# Altium project CPLD-V.PrjPcb
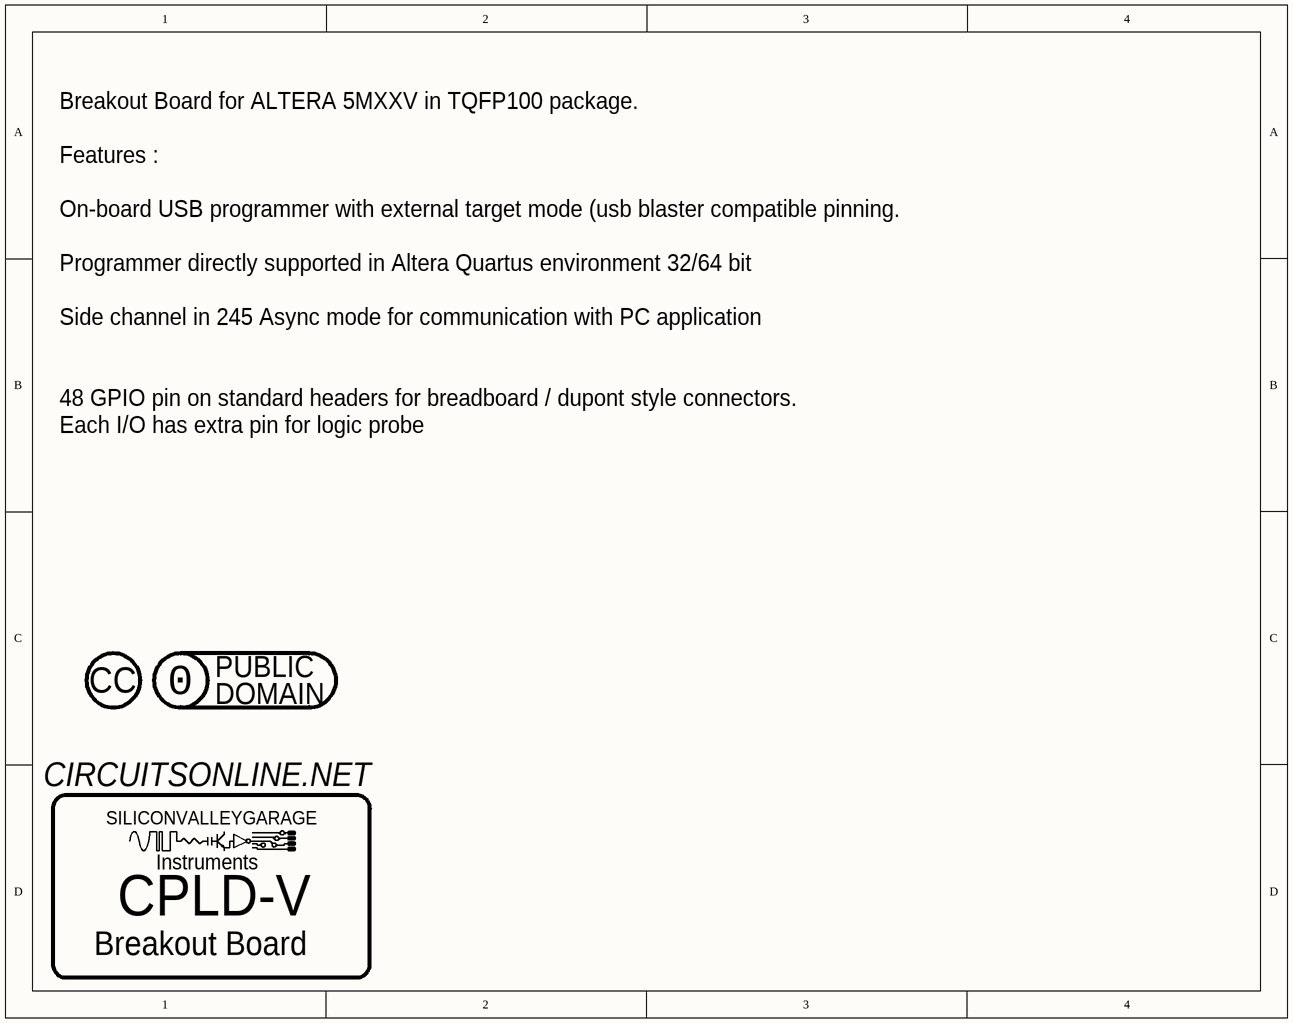
[diagram p0: CPLD-V INFORMATION.SchDoc]
SCHdrafter: Vincent Himpe
3 sheets, 167 parts. Net scope: hierarchical (ports join the sheet entries above them; power ports are global).
Board file: CPLD-V.PcbDoc
Sheets:
  CPLD-V INFORMATION.SchDoc
  CPLD-V MAIN.SchDoc
    U_CPLD-V-HEADERBANK = CPLD-V-HEADERBANK.SchDoc
    U_CPLD-V-HEADERBANK = CPLD-V-HEADERBANK.SchDoc
    U_CPLD-V-HEADERBANK = CPLD-V-HEADERBANK.SchDoc
    U_CPLD-V-HEADERBANK = CPLD-V-HEADERBANK.SchDoc
    U_CPLD-V-HEADERBANK = CPLD-V-HEADERBANK.SchDoc
    U_CPLD-V-HEADERBANK = CPLD-V-HEADERBANK.SchDoc

## Sheet CPLD-V INFORMATION.SchDoc
size A; SheetNumber: 1; SheetTotal: 3

### Parts
(Parts that share a designator on the sheet are numbered #1, #2 ... from top to bottom, then left to right.)
LOGO5  LOGO-LICENSE-CC0-PUBLIC  [LOGO-LICENSE-CC0-PUBLIC]  (value not drawn)  (no BOM)
LOGO6  LOGO-LICENSE-CC  [LOGO-LICENSE-CC]  (value not drawn)  (no BOM)
LOGO?#1  LOGO-SILICONVALLEYGARAGE-SMALL  [SILICONVALLEYGARAGE]  (value not drawn)  (graphical)

### Blocks framed on the sheet
CPLD-V: LOGO?#1

### Notes on the sheet
- Breakout Board for ALTERA 5MXXV in TQFP100 package.
  Features :
  On-board USB programmer with external target mode (usb blaster compatible pinning.
  Programmer directly supported in Altera Quartus environment 32/64 bit
  Side channel in 245 Async mode for communication with PC application
  48 GPIO pin on standard headers for breadboard / dupont style connectors.
  Each I/O has extra pin for logic probe
- (near LOGO?#1) CIRCUITSONLINE.NET
- (near LOGO?#1) Instruments
- Breakout Board
- (in symbol LOGO-LICENSE-CC) CC
- (in symbol LOGO-LICENSE-CC0-PUBLIC) PUBLIC; 0; DOMAIN
- (in symbol LOGO-SILICONVALLEYGARAGE-SMALL) SILICONVALLEYGARAGE

### Library data of the parts
LOGO?#1 = LOGO-SILICONVALLEYGARAGE-SMALL: LOGO,SILICONVALLEYGARAGE,SMALL

## Sheet CPLD-V MAIN.SchDoc
size A2; SheetNumber: 2; SheetTotal: 3
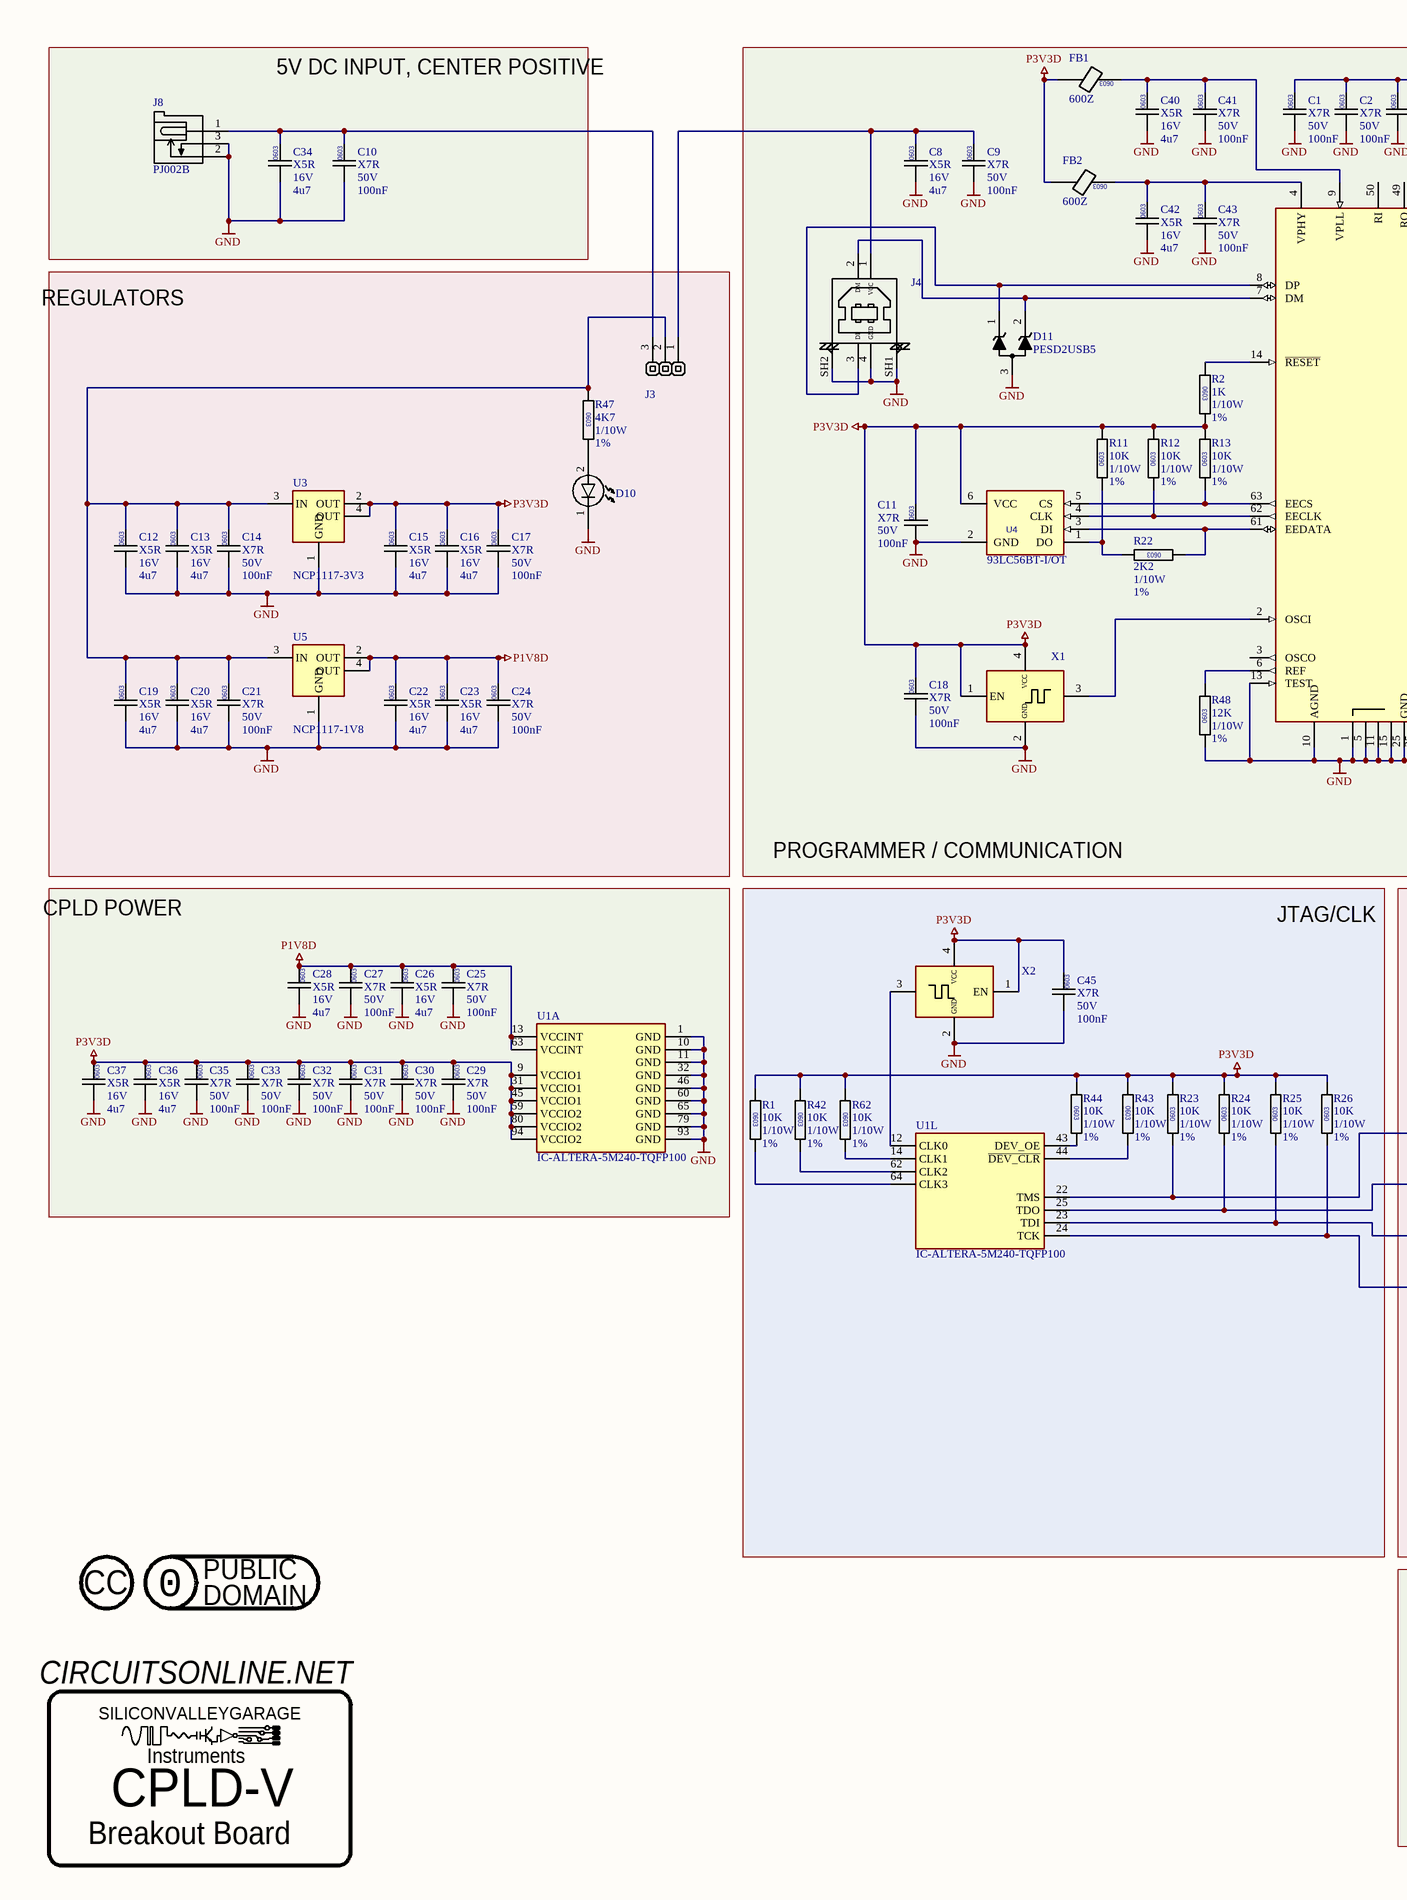
[diagram p1: CPLD-V MAIN.SchDoc, left]
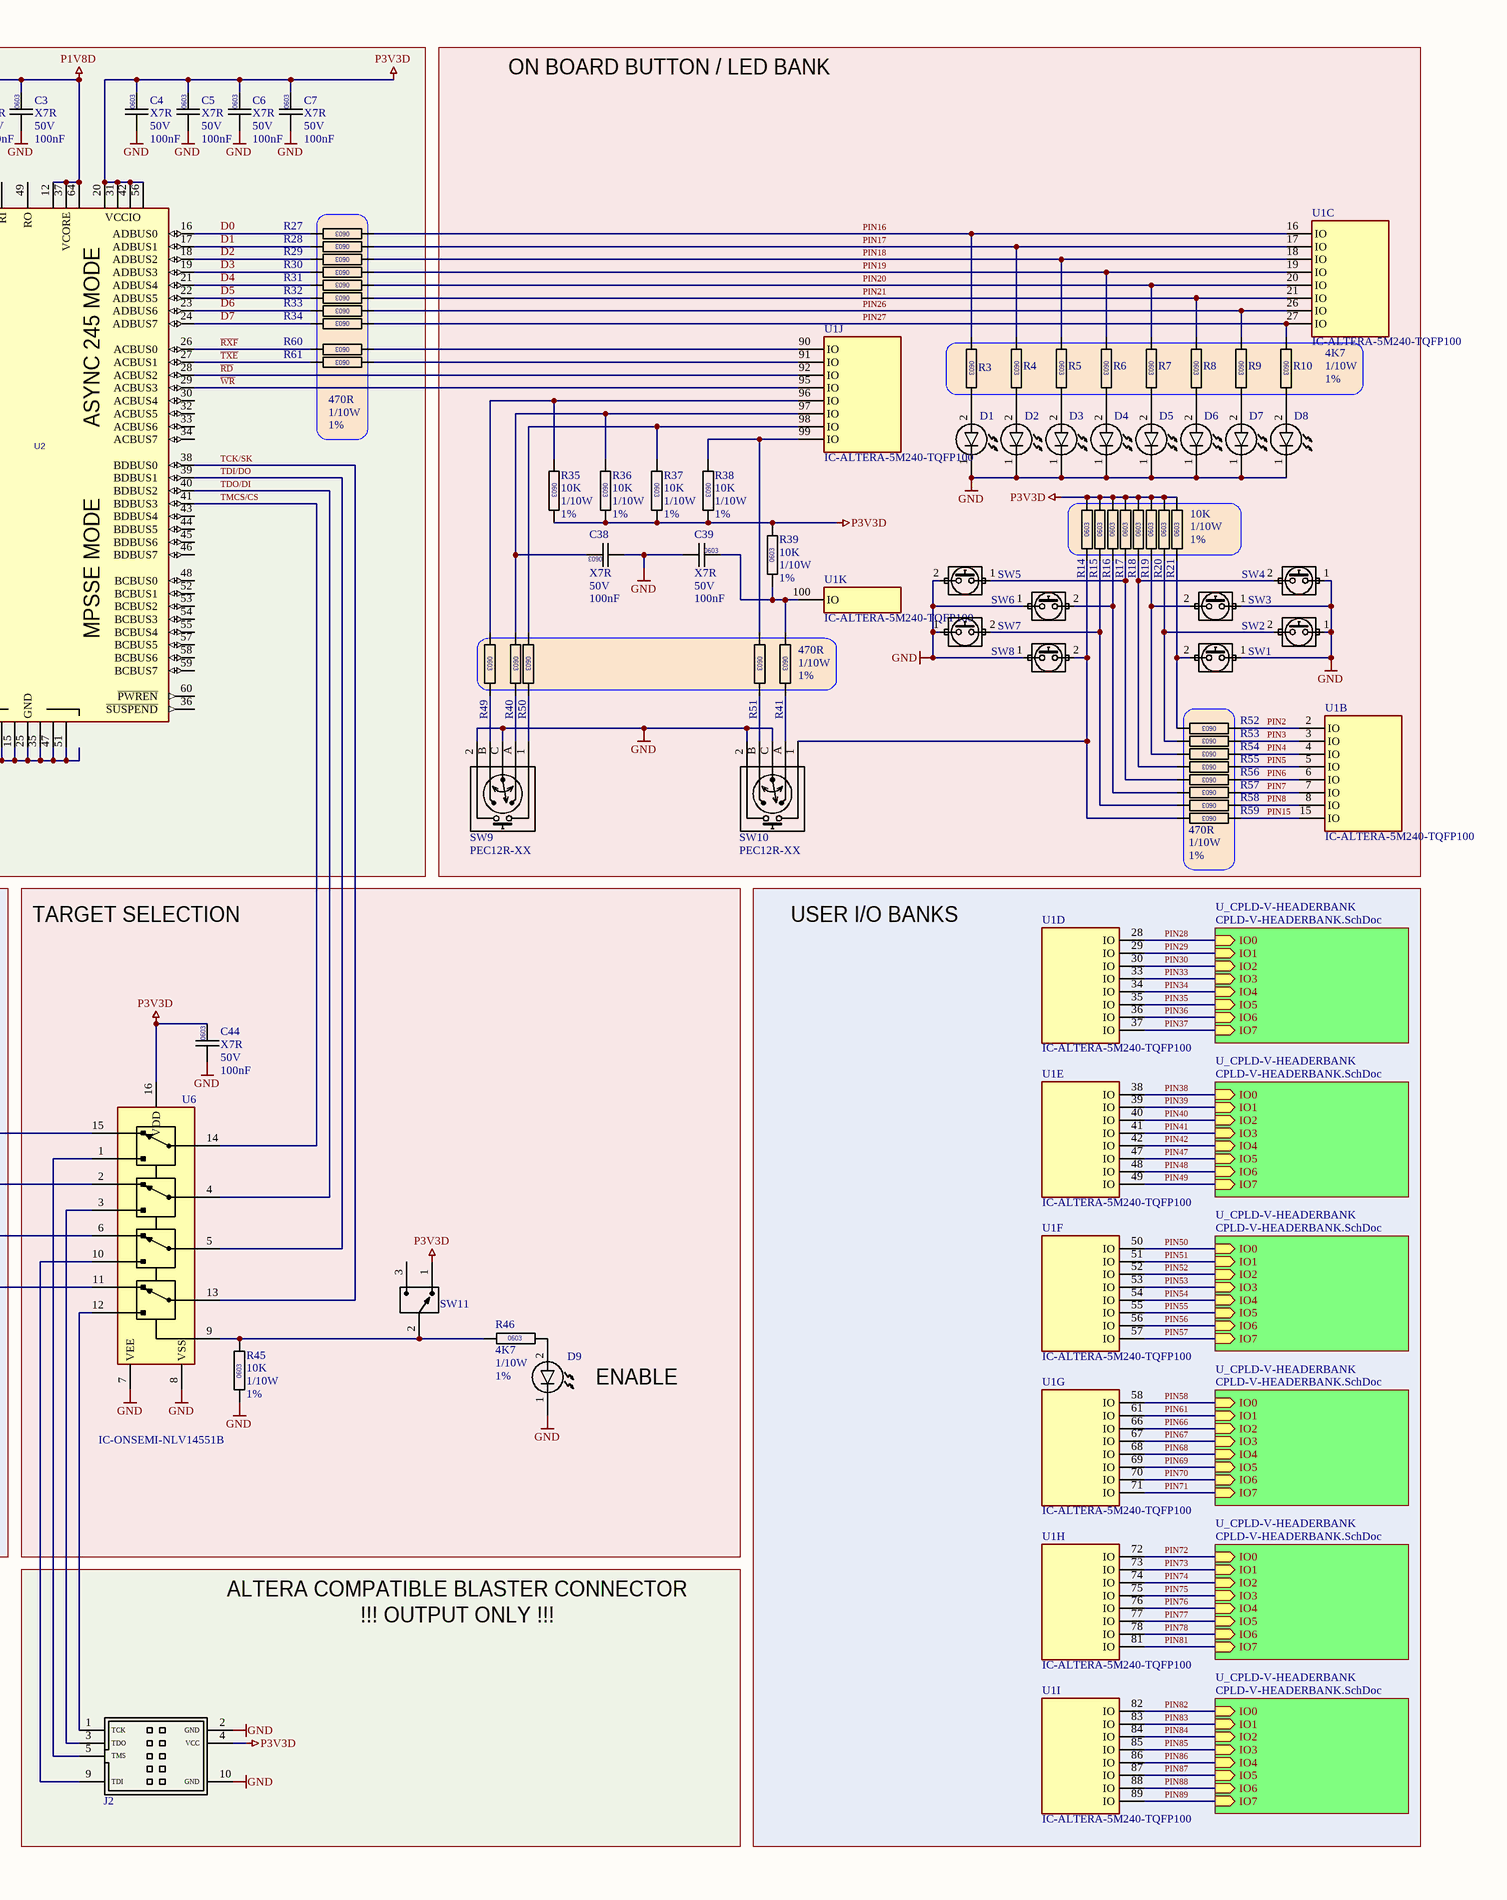
[diagram p2: CPLD-V MAIN.SchDoc, right]

### Parts
(Parts that share a designator on the sheet are numbered #1, #2 ... from top to bottom, then left to right.)
C1  Dielectric: X7R  Voltage: 50V  Capacitance: 100nF  [CAPC0603]  (hidden comment: CAP0603)
C2  Dielectric: X7R  Voltage: 50V  Capacitance: 100nF  [CAPC0603]  (hidden comment: CAP0603)
C3  Dielectric: X7R  Voltage: 50V  Capacitance: 100nF  [CAPC0603]  (hidden comment: CAP0603)
C4  Dielectric: X7R  Voltage: 50V  Capacitance: 100nF  [CAPC0603]  (hidden comment: CAP0603)
C5  Dielectric: X7R  Voltage: 50V  Capacitance: 100nF  [CAPC0603]  (hidden comment: CAP0603)
C6  Dielectric: X7R  Voltage: 50V  Capacitance: 100nF  [CAPC0603]  (hidden comment: CAP0603)
C7  Dielectric: X7R  Voltage: 50V  Capacitance: 100nF  [CAPC0603]  (hidden comment: CAP0603)
C8  Dielectric: X5R  Voltage: 16V  Capacitance: 4u7  [CAPC0603]  (hidden comment: CAP0603)
C9  Dielectric: X7R  Voltage: 50V  Capacitance: 100nF  [CAPC0603]  (hidden comment: CAP0603)
C10  Dielectric: X7R  Voltage: 50V  Capacitance: 100nF  [CAPC0603]  (hidden comment: CAP0603)
C11  Dielectric: X7R  Voltage: 50V  Capacitance: 100nF  [CAPC0603]  (hidden comment: CAP0603)
C12  Dielectric: X5R  Voltage: 16V  Capacitance: 4u7  [CAPC0603]  (hidden comment: CAP0603)
C13  Dielectric: X5R  Voltage: 16V  Capacitance: 4u7  [CAPC0603]  (hidden comment: CAP0603)
C14  Dielectric: X7R  Voltage: 50V  Capacitance: 100nF  [CAPC0603]  (hidden comment: CAP0603)
C15  Dielectric: X5R  Voltage: 16V  Capacitance: 4u7  [CAPC0603]  (hidden comment: CAP0603)
C16  Dielectric: X5R  Voltage: 16V  Capacitance: 4u7  [CAPC0603]  (hidden comment: CAP0603)
C17  Dielectric: X7R  Voltage: 50V  Capacitance: 100nF  [CAPC0603]  (hidden comment: CAP0603)
C18  Dielectric: X7R  Voltage: 50V  Capacitance: 100nF  [CAPC0603]  (hidden comment: CAP0603)
C19  Dielectric: X5R  Voltage: 16V  Capacitance: 4u7  [CAPC0603]  (hidden comment: CAP0603)
C20  Dielectric: X5R  Voltage: 16V  Capacitance: 4u7  [CAPC0603]  (hidden comment: CAP0603)
C21  Dielectric: X7R  Voltage: 50V  Capacitance: 100nF  [CAPC0603]  (hidden comment: CAP0603)
C22  Dielectric: X5R  Voltage: 16V  Capacitance: 4u7  [CAPC0603]  (hidden comment: CAP0603)
C23  Dielectric: X5R  Voltage: 16V  Capacitance: 4u7  [CAPC0603]  (hidden comment: CAP0603)
C24  Dielectric: X7R  Voltage: 50V  Capacitance: 100nF  [CAPC0603]  (hidden comment: CAP0603)
C25  Dielectric: X7R  Voltage: 50V  Capacitance: 100nF  [CAPC0603]  (hidden comment: CAP0603)
C26  Dielectric: X5R  Voltage: 16V  Capacitance: 4u7  [CAPC0603]  (hidden comment: CAP0603)
C27  Dielectric: X7R  Voltage: 50V  Capacitance: 100nF  [CAPC0603]  (hidden comment: CAP0603)
C28  Dielectric: X5R  Voltage: 16V  Capacitance: 4u7  [CAPC0603]  (hidden comment: CAP0603)
C29  Dielectric: X7R  Voltage: 50V  Capacitance: 100nF  [CAPC0603]  (hidden comment: CAP0603)
C30  Dielectric: X7R  Voltage: 50V  Capacitance: 100nF  [CAPC0603]  (hidden comment: CAP0603)
C31  Dielectric: X7R  Voltage: 50V  Capacitance: 100nF  [CAPC0603]  (hidden comment: CAP0603)
C32  Dielectric: X7R  Voltage: 50V  Capacitance: 100nF  [CAPC0603]  (hidden comment: CAP0603)
C33  Dielectric: X7R  Voltage: 50V  Capacitance: 100nF  [CAPC0603]  (hidden comment: CAP0603)
C34  Dielectric: X5R  Voltage: 16V  Capacitance: 4u7  [CAPC0603]  (hidden comment: CAP0603)
C35  Dielectric: X7R  Voltage: 50V  Capacitance: 100nF  [CAPC0603]  (hidden comment: CAP0603)
C36  Dielectric: X5R  Voltage: 16V  Capacitance: 4u7  [CAPC0603]  (hidden comment: CAP0603)
C37  Dielectric: X5R  Voltage: 16V  Capacitance: 4u7  [CAPC0603]  (hidden comment: CAP0603)
C38  Dielectric: X7R  Voltage: 50V  Capacitance: 100nF  [CAPC0603]  (hidden comment: CAP0603)
C39  Dielectric: X7R  Voltage: 50V  Capacitance: 100nF  [CAPC0603]  (hidden comment: CAP0603)
C40  Dielectric: X5R  Voltage: 16V  Capacitance: 4u7  [CAPC0603]  (hidden comment: CAP0603)
C41  Dielectric: X7R  Voltage: 50V  Capacitance: 100nF  [CAPC0603]  (hidden comment: CAP0603)
C42  Dielectric: X5R  Voltage: 16V  Capacitance: 4u7  [CAPC0603]  (hidden comment: CAP0603)
C43  Dielectric: X7R  Voltage: 50V  Capacitance: 100nF  [CAPC0603]  (hidden comment: CAP0603)
C44  Dielectric: X7R  Voltage: 50V  Capacitance: 100nF  [CAPC0603]  (hidden comment: CAP0603)
C45  Dielectric: X7R  Voltage: 50V  Capacitance: 100nF  [CAPC0603]  (hidden comment: CAP0603)
D1  KT-0603W  [LED-0603-GREEN]  (value not drawn)
D2  KT-0603W  [LED-0603-GREEN]  (value not drawn)
D3  KT-0603W  [LED-0603-GREEN]  (value not drawn)
D4  KT-0603W  [LED-0603-GREEN]  (value not drawn)
D5  KT-0603W  [LED-0603-GREEN]  (value not drawn)
D6  KT-0603W  [LED-0603-GREEN]  (value not drawn)
D7  KT-0603W  [LED-0603-GREEN]  (value not drawn)
D8  KT-0603W  [LED-0603-GREEN]  (value not drawn)
D9  KT-0603W  [LED-0603-GREEN]  (value not drawn)
D10  KT-0603W  [LED-0603-GREEN]  (value not drawn)
D11  PESD2USB5  [SOT23]
FB1  value 600Z  [FB0603]  (hidden comment: FB0603)
FB2  value 600Z  [FB0603]  (hidden comment: FB0603)
J2  ALTERA  [CONNECTOR GENERIC-BOXHEADER-2X5]  (value not drawn)
J3  BOXHEADER-2X4  [HEADER-GENERIC-MALE-1X3]  (value not drawn)
J4  CONN-CUI-UJ2-BH-BL1-TH  [CONN-CUI-UJ2-BH-BL1-TH]  (value not drawn)
J8  PJ002B  [CONN-CUI-PJ-002B]
LOGO1  LOGO-LICENSE-CC0-PUBLIC  [LOGO-LICENSE-CC0-PUBLIC]  (value not drawn)  (no BOM)
LOGO2  LOGO-LICENSE-CC  [LOGO-LICENSE-CC]  (value not drawn)  (no BOM)
LOGO?#2  LOGO-SILICONVALLEYGARAGE-SMALL  [SILICONVALLEYGARAGE]  (value not drawn)  (graphical)
R1  value 10K  Power: 1/10W  Tolerance: 1%  [RESC0603]  (hidden comment: RESC0603)
R2  value 1K  Power: 1/10W  Tolerance: 1%  [RESC0603]  (hidden comment: RESC0603)
R3  value 4K7  Power: 1/10W  Tolerance: 1%  [RESC0603]  (hidden comment: RESC0603)
R4  RESC0603  [RESC0603]  (value not drawn)
R5  RESC0603  [RESC0603]  (value not drawn)
R6  RESC0603  [RESC0603]  (value not drawn)
R7  RESC0603  [RESC0603]  (value not drawn)
R8  RESC0603  [RESC0603]  (value not drawn)
R9  RESC0603  [RESC0603]  (value not drawn)
R10  RESC0603  [RESC0603]  (value not drawn)
R11  value 10K  Power: 1/10W  Tolerance: 1%  [RESC0603]  (hidden comment: RESC0603)
R12  value 10K  Power: 1/10W  Tolerance: 1%  [RESC0603]  (hidden comment: RESC0603)
R13  value 10K  Power: 1/10W  Tolerance: 1%  [RESC0603]  (hidden comment: RESC0603)
R14  value 10K  Power: 1/10W  Tolerance: 1%  [RESC0603]  (hidden comment: RESC0603)
R15  RESC0603  [RESC0603]  (value not drawn)
R16  RESC0603  [RESC0603]  (value not drawn)
R17  RESC0603  [RESC0603]  (value not drawn)
R18  RESC0603  [RESC0603]  (value not drawn)
R19  RESC0603  [RESC0603]  (value not drawn)
R20  RESC0603  [RESC0603]  (value not drawn)
R21  RESC0603  [RESC0603]  (value not drawn)
R22  value 2K2  Power: 1/10W  Tolerance: 1%  [RESC0603]  (hidden comment: RESC0603)
R23  value 10K  Power: 1/10W  Tolerance: 1%  [RESC0603]  (hidden comment: RESC0603)
R24  value 10K  Power: 1/10W  Tolerance: 1%  [RESC0603]  (hidden comment: RESC0603)
R25  value 10K  Power: 1/10W  Tolerance: 1%  [RESC0603]  (hidden comment: RESC0603)
R26  value 10K  Power: 1/10W  Tolerance: 1%  [RESC0603]  (hidden comment: RESC0603)
R27  RESC0603  [RESC0603]  (value not drawn)
R28  RESC0603  [RESC0603]  (value not drawn)
R29  RESC0603  [RESC0603]  (value not drawn)
R30  RESC0603  [RESC0603]  (value not drawn)
R31  RESC0603  [RESC0603]  (value not drawn)
R32  RESC0603  [RESC0603]  (value not drawn)
R33  RESC0603  [RESC0603]  (value not drawn)
R34  RESC0603  [RESC0603]  (value not drawn)
R35  value 10K  Power: 1/10W  Tolerance: 1%  [RESC0603]  (hidden comment: RESC0603)
R36  value 10K  Power: 1/10W  Tolerance: 1%  [RESC0603]  (hidden comment: RESC0603)
R37  value 10K  Power: 1/10W  Tolerance: 1%  [RESC0603]  (hidden comment: RESC0603)
R38  value 10K  Power: 1/10W  Tolerance: 1%  [RESC0603]  (hidden comment: RESC0603)
R39  value 10K  Power: 1/10W  Tolerance: 1%  [RESC0603]  (hidden comment: RESC0603)
R40  RESC0603  [RESC0603]  (value not drawn)
R41  value 470R  Power: 1/10W  Tolerance: 1%  [RESC0603]  (hidden comment: RESC0603)
R42  value 10K  Power: 1/10W  Tolerance: 1%  [RESC0603]  (hidden comment: RESC0603)
R43  value 10K  Power: 1/10W  Tolerance: 1%  [RESC0603]  (hidden comment: RESC0603)
R44  value 10K  Power: 1/10W  Tolerance: 1%  [RESC0603]  (hidden comment: RESC0603)
R45  value 10K  Power: 1/10W  Tolerance: 1%  [RESC0603]  (hidden comment: RESC0603)
R46  value 4K7  Power: 1/10W  Tolerance: 1%  [RESC0603]  (hidden comment: RESC0603)
R47  value 4K7  Power: 1/10W  Tolerance: 1%  [RESC0603]  (hidden comment: RESC0603)
R48  value 12K  Power: 1/10W  Tolerance: 1%  [RESC0603]  (hidden comment: RESC0603)
R49  RESC0603  [RESC0603]  (value not drawn)
R50  RESC0603  [RESC0603]  (value not drawn)
R51  RESC0603  [RESC0603]  (value not drawn)
R52  RESC0603  [RESC0603]  (value not drawn)
R53  RESC0603  [RESC0603]  (value not drawn)
R54  RESC0603  [RESC0603]  (value not drawn)
R55  RESC0603  [RESC0603]  (value not drawn)
R56  RESC0603  [RESC0603]  (value not drawn)
R57  RESC0603  [RESC0603]  (value not drawn)
R58  RESC0603  [RESC0603]  (value not drawn)
R59  value 470R  Power: 1/10W  Tolerance: 1%  [RESC0603]  (hidden comment: RESC0603)
R60  RESC0603  [RESC0603]  (value not drawn)
R61  value 470R  Power: 1/10W  Tolerance: 1%  [RESC0603]  (hidden comment: RESC0603)
R62  value 10K  Power: 1/10W  Tolerance: 1%  [RESC0603]  (hidden comment: RESC0603)
SW1  SWITCH-XUNPU-TS-1088-AR02016  [SWITCH-XUNPU-TS-1088-AR02016]  (value not drawn)
SW2  SWITCH-XUNPU-TS-1088-AR02016  [SWITCH-XUNPU-TS-1088-AR02016]  (value not drawn)
SW3  SWITCH-XUNPU-TS-1088-AR02016  [SWITCH-XUNPU-TS-1088-AR02016]  (value not drawn)
SW4  SWITCH-XUNPU-TS-1088-AR02016  [SWITCH-XUNPU-TS-1088-AR02016]  (value not drawn)
SW5  SWITCH-XUNPU-TS-1088-AR02016  [SWITCH-XUNPU-TS-1088-AR02016]  (value not drawn)
SW6  SWITCH-XUNPU-TS-1088-AR02016  [SWITCH-XUNPU-TS-1088-AR02016]  (value not drawn)
SW7  SWITCH-XUNPU-TS-1088-AR02016  [SWITCH-XUNPU-TS-1088-AR02016]  (value not drawn)
SW8  SWITCH-XUNPU-TS-1088-AR02016  [SWITCH-XUNPU-TS-1088-AR02016]  (value not drawn)
SW9  PEC12R-XX  [SWITCH-BOURNS-PEC12R-4120F-S0012]
SW10  PEC12R-XX  [SWITCH-BOURNS-PEC12R-4120F-S0012]
SW11  SWITCH-WURTH-450301014042  [SWITCH-WURTH-450301014042]  (value not drawn)
U1  IC-ALTERA-5M240-TQFP100  [QFP50P1600X1600X160-100N]  (parts A,B,C,D,E,F,G,H,I,J,K,L of 12)
U2  FT2232H  [QFP50P1000X1000X100-64N]  (value not drawn)
U3  NCP1117-3V3  [SOT223-4N]
U4  93LC56BT-I/OT  [SOT23-6]
U5  NCP1117-1V8  [SOT223-4N]
U6  IC-ONSEMI-NLV14551B  [SO127P600-16N]
X1  XOSC  [XTAL-ABRACON-ABM8-272-T3]  (value not drawn)
X2  XOSC  [XOSC3225]  (value not drawn)

### Blocks framed on the sheet
5V DC INPUT, CENTER POSITIVE: C10 C34 J8
ON BOARD BUTTON / LED BANK: C38 C39 D1-D8 R3-R10 R14-R21 R35-R41 R49-R59 SW1-SW10 U1
REGULATORS: C12-C17 C19-C24 D10 J3 R47 U3 U5
CPLD POWER: C25-C33 C35-C37 U1
JTAG/CLK: C45 R1 R23-R26 R42-R44 R62 U1 X2
USER I/O BANKS: U1
CPLD-V: LOGO?#2

### Sub-sheets
U_CPLD-V-HEADERBANK = CPLD-V-HEADERBANK.SchDoc: IO0 (in), IO1 (in), IO2 (in), IO3 (in), IO4 (in), IO5 (in), IO6 (in), IO7 (in)
U_CPLD-V-HEADERBANK = CPLD-V-HEADERBANK.SchDoc: IO0 (in), IO1 (in), IO2 (in), IO3 (in), IO4 (in), IO5 (in), IO6 (in), IO7 (in)
U_CPLD-V-HEADERBANK = CPLD-V-HEADERBANK.SchDoc: IO0 (in), IO1 (in), IO2 (in), IO3 (in), IO4 (in), IO5 (in), IO6 (in), IO7 (in)
U_CPLD-V-HEADERBANK = CPLD-V-HEADERBANK.SchDoc: IO0 (in), IO1 (in), IO2 (in), IO3 (in), IO4 (in), IO5 (in), IO6 (in), IO7 (in)
U_CPLD-V-HEADERBANK = CPLD-V-HEADERBANK.SchDoc: IO0 (in), IO1 (in), IO2 (in), IO3 (in), IO4 (in), IO5 (in), IO6 (in), IO7 (in)
U_CPLD-V-HEADERBANK = CPLD-V-HEADERBANK.SchDoc: IO0 (in), IO1 (in), IO2 (in), IO3 (in), IO4 (in), IO5 (in), IO6 (in), IO7 (in)

### Nets
GND: C1.2 C2.2 C3.2 C4.2 C5.2 C6.2 C7.2 C8.2 C9.2 C10.2 C11.2 C12.2 C13.2 C14.2 C15.2 C16.2 C17.2 C18.2 C19.2 C20.2 C21.2 C22.2 C23.2 C24.2 C25.2 C26.2 C27.2 C28.2 C29.2 C30.2 C31.2 C32.2 C33.2 C34.2 C35.2 C36.2 C37.2 C38.2 C39.2 C40.2 C41.2 C42.2 C43.2 C44.2 C45.2 D1.1(A) D2.1(A) D3.1(A) D4.1(A) D5.1(A) D6.1(A) D7.1(A) D8.1(A) D9.1(A) D10.1(A) D11.3(A) J2.2(GND) J2.10(GND) J4.4(GND) J4.SH1(NO) J4.SH2(NO) J8.2 J8.3 R45.2 R48.2 SW1.1 SW2.1 SW3.1 SW4.1 SW5.2 SW6.1 SW7.1 SW8.1 SW9.2 SW9.C SW10.2 SW10.C U1.1(GND) U1.10(GND) U1.11(GND) U1.32(GND) U1.46(GND) U1.60(GND) U1.65(GND) U1.79(GND) U1.93(GND) U2.1(GND) U2.5(GND) U2.10(AGND) U2.11(GND) U2.13(TEST) U2.15(GND) U2.25(GND) U2.35(GND) U2.47(GND) U2.51(GND) U3.1(GND) U4.2(GND) U5.1(GND) U6.7(VEE) U6.8(VSS) X1.2(GND) X2.2(GND)
P1V8D: C1.1 C2.1 C3.1 C22.1 C23.1 C24.1 C25.1 C26.1 C27.1 C28.1 U1.13(VCCINT) U1.63(VCCINT) U2.12(VCORE) U2.37(VCORE) U2.64(VCORE) U5.2(OUT) U5.4(OUT)
P3V3D: C4.1 C5.1 C6.1 C7.1 C11.1 C15.1 C16.1 C17.1 C18.1 C29.1 C30.1 C31.1 C32.1 C33.1 C35.1 C36.1 C37.1 C44.1 C45.1 FB1.2 FB2.2 J2.4(VCC) R1.2 R2.1 R11.1 R12.1 R13.1 R14.1 R15.1 R16.1 R17.1 R18.1 R19.1 R20.1 R21.1 R23.1 R24.1 R25.1 R26.1 R35.1 R36.1 R37.1 R38.1 R39.1 R42.2 R43.2 R44.2 R62.2 SW11.1 U1.9(VCCIO1) U1.31(VCCIO1) U1.45(VCCIO1) U1.59(VCCIO2) U1.80(VCCIO2) U1.94(VCCIO2) U2.20(VCCIO) U2.31(VCCIO) U2.42(VCCIO) U2.56(VCCIO) U3.2(OUT) U3.4(OUT) U4.6(VCC) U6.16(VDD) X1.1(EN) X1.4(VCC) X2.1(EN) X2.4(VCC)
D0: R27.1 U2.16(ADBUS0)
D1: R28.1 U2.17(ADBUS1)
D2: R29.1 U2.18(ADBUS2)
D3: R30.1 U2.19(ADBUS3)
D4: R31.1 U2.21(ADBUS4)
D5: R32.1 U2.22(ADBUS5)
D6: R33.1 U2.23(ADBUS6)
D7: R34.1 U2.24(ADBUS7)
PIN2: R52.2 U1.2(IO)
PIN3: R53.2 U1.3(IO)
PIN4: R54.2 U1.4(IO)
PIN5: R55.2 U1.5(IO)
PIN6: R56.2 U1.6(IO)
PIN7: R57.2 U1.7(IO)
PIN8: R58.2 U1.8(IO)
PIN15: R59.2 U1.15(IO)
PIN16: R3.2 R27.2 U1.16(IO)
PIN17: R4.2 R28.2 U1.17(IO)
PIN18: R5.2 R29.2 U1.18(IO)
PIN19: R6.2 R30.2 U1.19(IO)
PIN20: R7.2 R31.2 U1.20(IO)
PIN21: R8.2 R32.2 U1.21(IO)
PIN26: R9.2 R33.2 U1.26(IO)
PIN27: R10.2 R34.2 U1.27(IO)
PIN28: U1.28(IO) ; sheet U_CPLD-V-HEADERBANK/IO0
PIN29: U1.29(IO) ; sheet U_CPLD-V-HEADERBANK/IO1
PIN30: U1.30(IO) ; sheet U_CPLD-V-HEADERBANK/IO2
PIN33: U1.33(IO) ; sheet U_CPLD-V-HEADERBANK/IO3
PIN34: U1.34(IO) ; sheet U_CPLD-V-HEADERBANK/IO4
PIN35: U1.35(IO) ; sheet U_CPLD-V-HEADERBANK/IO5
PIN36: U1.36(IO) ; sheet U_CPLD-V-HEADERBANK/IO6
PIN37: U1.37(IO) ; sheet U_CPLD-V-HEADERBANK/IO7
PIN38: U1.38(IO) ; sheet U_CPLD-V-HEADERBANK/IO0
PIN39: U1.39(IO) ; sheet U_CPLD-V-HEADERBANK/IO1
PIN40: U1.40(IO) ; sheet U_CPLD-V-HEADERBANK/IO2
PIN41: U1.41(IO) ; sheet U_CPLD-V-HEADERBANK/IO3
PIN42: U1.42(IO) ; sheet U_CPLD-V-HEADERBANK/IO4
PIN47: U1.47(IO) ; sheet U_CPLD-V-HEADERBANK/IO5
PIN48: U1.48(IO) ; sheet U_CPLD-V-HEADERBANK/IO6
PIN49: U1.49(IO) ; sheet U_CPLD-V-HEADERBANK/IO7
PIN50: U1.50(IO) ; sheet U_CPLD-V-HEADERBANK/IO0
PIN51: U1.51(IO) ; sheet U_CPLD-V-HEADERBANK/IO1
PIN52: U1.52(IO) ; sheet U_CPLD-V-HEADERBANK/IO2
PIN53: U1.53(IO) ; sheet U_CPLD-V-HEADERBANK/IO3
PIN54: U1.54(IO) ; sheet U_CPLD-V-HEADERBANK/IO4
PIN55: U1.55(IO) ; sheet U_CPLD-V-HEADERBANK/IO5
PIN56: U1.56(IO) ; sheet U_CPLD-V-HEADERBANK/IO6
PIN57: U1.57(IO) ; sheet U_CPLD-V-HEADERBANK/IO7
PIN58: U1.58(IO) ; sheet U_CPLD-V-HEADERBANK/IO0
PIN61: U1.61(IO) ; sheet U_CPLD-V-HEADERBANK/IO1
PIN66: U1.66(IO) ; sheet U_CPLD-V-HEADERBANK/IO2
PIN67: U1.67(IO) ; sheet U_CPLD-V-HEADERBANK/IO3
PIN68: U1.68(IO) ; sheet U_CPLD-V-HEADERBANK/IO4
PIN69: U1.69(IO) ; sheet U_CPLD-V-HEADERBANK/IO5
PIN70: U1.70(IO) ; sheet U_CPLD-V-HEADERBANK/IO6
PIN71: U1.71(IO) ; sheet U_CPLD-V-HEADERBANK/IO7
PIN72: U1.72(IO) ; sheet U_CPLD-V-HEADERBANK/IO0
PIN73: U1.73(IO) ; sheet U_CPLD-V-HEADERBANK/IO1
PIN74: U1.74(IO) ; sheet U_CPLD-V-HEADERBANK/IO2
PIN75: U1.75(IO) ; sheet U_CPLD-V-HEADERBANK/IO3
PIN76: U1.76(IO) ; sheet U_CPLD-V-HEADERBANK/IO4
PIN77: U1.77(IO) ; sheet U_CPLD-V-HEADERBANK/IO5
PIN78: U1.78(IO) ; sheet U_CPLD-V-HEADERBANK/IO6
PIN81: U1.81(IO) ; sheet U_CPLD-V-HEADERBANK/IO7
PIN82: U1.82(IO) ; sheet U_CPLD-V-HEADERBANK/IO0
PIN83: U1.83(IO) ; sheet U_CPLD-V-HEADERBANK/IO1
PIN84: U1.84(IO) ; sheet U_CPLD-V-HEADERBANK/IO2
PIN85: U1.85(IO) ; sheet U_CPLD-V-HEADERBANK/IO3
PIN86: U1.86(IO) ; sheet U_CPLD-V-HEADERBANK/IO4
PIN87: U1.87(IO) ; sheet U_CPLD-V-HEADERBANK/IO5
PIN88: U1.88(IO) ; sheet U_CPLD-V-HEADERBANK/IO6
PIN89: U1.89(IO) ; sheet U_CPLD-V-HEADERBANK/IO7
~{RD}: U1.92(IO) U2.28(ACBUS2)
~{RXF}: R60.1 U2.26(ACBUS0)
~{TXE}: R61.1 U2.27(ACBUS1)
TCK/SK: U2.38(BDBUS0) U6.13(Z)
TDI/DO: U2.39(BDBUS1) U6.5(Y)
TDO/DI: U2.40(BDBUS2) U6.4(X)
TMCS/CS: U2.41(BDBUS3) U6.14(W)
~{WR}: U1.95(IO) U2.29(ACBUS3)
NetC8_1: C8.1 C9.1 J3.1(+) J4.1(VCC)
NetC10_1: C10.1 C34.1 J3.3(-) J8.1
NetC12_1: C12.1 C13.1 C14.1 C19.1 C20.1 C21.1 J3.2(-) R47.2 U3.3(IN) U5.3(IN)
NetC38_1: C38.1 R36.2 R40.2 U1.97(IO)
NetC39_1: C39.1 R39.2 R41.2 U1.100(IO)
NetC40_1: C40.1 C41.1 FB1.1 U2.9(VPLL)
NetC42_1: C42.1 C43.1 FB2.1 U2.4(VPHY)
NetD1_2: D1.2(K) R3.1
NetD2_2: D2.2(K) R4.1
NetD3_2: D3.2(K) R5.1
NetD4_2: D4.2(K) R6.1
NetD5_2: D5.2(K) R7.1
NetD6_2: D6.2(K) R8.1
NetD7_2: D7.2(K) R9.1
NetD8_2: D8.2(K) R10.1
NetD9_2: D9.2(K) R46.1
NetD10_2: D10.2(K) R47.1
NetD11_1: D11.1(K) J4.3(DP) U2.8(DP)
NetD11_2: D11.2(A) J4.2(DM) U2.7(DM)
NetJ2_1: J2.1(TCK) U6.12(Z1)
NetJ2_3: J2.3(TDO) U6.3(X1)
NetJ2_5: J2.5(TMS) U6.1(W1)
NetJ2_9: J2.9(TDI) U6.10(Y1)
NetR1_1: R1.1 U1.64(CLK3)
NetR2_2: R2.2 U2.14(~{RESET})
NetR11_2: R11.2 R22.1 U4.1(DO)
NetR12_2: R12.2 U2.62(EECLK) U4.4(CLK)
NetR13_2: R13.2 U2.63(EECS) U4.5(CS)
NetR14_2: R14.2 R59.1 SW8.2 SW10.1
NetR15_2: R15.2 R58.1 SW7.2
NetR16_2: R16.2 R57.1 SW6.2
NetR17_2: R17.2 R56.1 SW5.1
NetR18_2: R18.2 R55.1 SW4.2
NetR19_2: R19.2 R54.1 SW3.2
NetR20_2: R20.2 R53.1 SW2.2
NetR21_2: R21.2 R52.1 SW1.2
NetR22_2: R22.2 U2.61(EEDATA) U4.3(DI)
NetR23_2: R23.2 U1.22(TMS) U6.15(W0)
NetR24_2: R24.2 U1.25(TDO) U6.2(X0)
NetR25_2: R25.2 U1.23(TDI) U6.6(Y0)
NetR26_2: R26.2 U1.24(TCK) U6.11(Z0)
NetR35_2: R35.2 R49.2 U1.96(IO)
NetR37_2: R37.2 R50.2 U1.98(IO)
NetR38_2: R38.2 R51.2 U1.99(IO)
NetR40_1: R40.1 SW9.A
NetR41_1: R41.1 SW10.A
NetR42_1: R42.1 U1.62(CLK2)
NetR43_1: R43.1 U1.44(~{DEV_CLR})
NetR44_1: R44.1 U1.43(DEV_OE)
NetR45_1: R45.1 R46.2 SW11.2 U6.9(CTRL)
NetR48_1: R48.1 U2.6(REF)
NetR49_1: R49.1 SW9.B
NetR50_1: R50.1 SW9.1
NetR51_1: R51.1 SW10.B
NetR60_2: R60.2 U1.90(IO)
NetR61_2: R61.2 U1.91(IO)
NetR62_1: R62.1 U1.14(CLK1)
NetU1_12: U1.12(CLK0) X2.3(OSC2)
NetU2_2: U2.2(OSCI) X1.3(OSC2)

Not connected (* = marked no-connect by the designer): SW11 3; U2 3(OSCO) 30(ACBUS4) 32(ACBUS5) 33(ACBUS6) 34(ACBUS7) 36(~{SUSPEND}) 43(BDBUS4) 44(BDBUS5) 45(BDBUS6) 46(BDBUS7) 48(BCBUS0) 49(RO) 50(RI) 52(BCBUS1) 53(BCBUS2) 54(BCBUS3) 55(BCBUS4) 57(BCBUS5) 58(BCBUS6) 59(BCBUS7) 60(~{PWREN})

### Notes on the sheet
- (near U2) ASYNC 245 MODE
- (near U2) MPSSE MODE
- PROGRAMMER / COMMUNICATION
- TARGET SELECTION
- ENABLE
- ALTERA COMPATIBLE BLASTER CONNECTOR
- !!! OUTPUT ONLY !!!
- (near LOGO?#2) CIRCUITSONLINE.NET
- (near LOGO?#2) Instruments
- Breakout Board
- (in symbol FB0603-600Z-0R45) 0603
- (in symbol LOGO-LICENSE-CC) CC
- (in symbol LOGO-LICENSE-CC0-PUBLIC) PUBLIC; 0; DOMAIN
- (in symbol LOGO-SILICONVALLEYGARAGE-SMALL) SILICONVALLEYGARAGE
- (in symbol RESC-0603-1K-1%-1/10W) 0603
- (in symbol RESC-0603-2K2-1%-1/10W) 0603
- (in symbol RESC-0603-4K7-1%-1/10W) 0603
- (in symbol RESC-0603-10K-1%-1/10W) 0603
- (in symbol RESC-0603-12K-1%-1/10W) 0603
- (in symbol RESC-0603-470R-1%-1/10W) 0603

### Library data of the parts
C1-C7 C9-C11 C14 C17 C18 C21 C24 C25 C27 C29-C33 C35 C38 C39 C41 C43-C45 = CAPC-0603-100nF-50V-X7R: CAPACITOR,CERAMIC,100nF,50V,X7R,0603; Manufacturer 1: KEMET; Manufacturer Part Number 1: C0603C104K5RACTU; Package / Case: 0603; Location: *; LCSC: C14663; MOUSER: 80-C0603C104K5R
C8 C12 C13 C15 C16 C19 C20 C22 C23 C26 C28 C34 C36 C37 C40 C42 = CAPC-0603-4u7-10V-X5R_1: CAPACITOR,CERAMIC,4u7,16V,X5R,0603; Manufacturer 1: Samsung Electro-Mechanics; Manufacturer Part Number 1: CL10A475KO8NNNC; Package / Case: 0603; Location: *; LCSC: C19666
D1-D10 = LED-0603-WHITE: LED,SMD,WHITE,42mCd,0603; Manufacturer 1: Hubei KENTO Elec; LCSC: C2290; Manufacturer Part Number 1: KT-0603W
D11 = TVS-NEXPERIA-PESD2USB5UX-TR: DIODE,TVS,DUAL,NIDIRETIONAL,USB,PESD2USB5UX-TR,SOT23; DIGIKEY: 1727-PESD2USB5UX-CT-ND; LCSC: C3709087; Manufacturer 1: NEXPERIA; Manufacturer Part Number 1: PESD2USB5UX-TR
FB1 FB2 = FB0603-600Z-0R45: FERRITE,600Z@100MHz,0R452DC,0603; Manufacturer 1: SUNLORD; Manufacturer Part Number 1: GZ1608D601TF; LCSC: C1002
J2 = CONN-BOXHEADER-5X2-ALTERA: CONN,BOXHEADER,2X5,ALTERA JTAG PINOUT
J3 = CONN-HEADER-MALE-1x3: CONN,HEADER,1x3,2.54mm; LCSC: C429954
J4 = CONN-CUI-UJ2-BH-BL1-TH: CONN,USB2.0,B,RA,BLUE; LCSC: C720549
J8 = CONN-CUI-PJ002B: CONN,DCPOWER,BARREL,CUI,PJ002B; Manufacturer 1: XKB Connection; Manufacturer Part Number 1: DC-005-5A-2.5; LCSC: C381115
LOGO?#2 = LOGO-SILICONVALLEYGARAGE-SMALL: LOGO,SILICONVALLEYGARAGE,SMALL
R1 R11-R14 R23-R26 R35-R39 R42-R45 R62 = RESC-0603-10K-1%-1/10W: RESISTOR,10K,1%,100mW,0603 (1608); Manufacturer 1: YAGEO; Manufacturer Part Number 1: RC0603FR-0710KL; Location: *; LCSC: C25804; MOUSER: 603-RC0603FR-0710KL
R2 = RESC-0603-1K-1%-1/10W: RESISTOR,1K,1%,100mW,0603 (1608); Manufacturer 1: YAGEO; Manufacturer Part Number 1: RC0603FR-071KL; Location: *; LCSC: C21190; MOUSER: 603-RC0603FR-071KL
R3 R46 R47 = RESC-0603-4K7-1%-1/10W: RESISTOR,4K7,1%,100mW,0603 (1608); Manufacturer 1: YAGEO; Manufacturer Part Number 1: RC0603FR-074K7L; Location: *; LCSC: C23162; MOUSER: 603-RC0603FR-074K7L
R4-R10 = RESC-0603-4K7-1%-1/10W: RESISTOR,4K7,1%,100mW,0603 (1608); Manufacturer 1: YAGEO; Manufacturer Part Number 1: RC0603FR-074K7L; Power: 1/10W; Location: *; LCSC: C23162; MOUSER: 603-RC0603FR-074K7L; Tolerance: 1%; Value: 4K7
R15-R21 = RESC-0603-10K-1%-1/10W: RESISTOR,10K,1%,100mW,0603 (1608); Manufacturer 1: YAGEO; Manufacturer Part Number 1: RC0603FR-0710KL; Power: 1/10W; Location: *; LCSC: C25804; MOUSER: 603-RC0603FR-0710KL; Tolerance: 1%; Value: 10K
R22 = RESC-0603-2K2-1%-1/10W: RESISTOR,2K2,1%,100mW,0603 (1608); Location: *; LCSC: C4190
R27-R34 R40 R49-R58 R60 = RESC-0603-470R-1%-1/10W: RESISTOR,470R,1%,100mW,0603 (1608); Manufacturer 1: UNI-ROYAL; Manufacturer Part Number 1: 0603WAF4700T5E; Power: 1/10W; Location: *; LCSC: C23179; Tolerance: 1%; Value: 470R
R41 R59 R61 = RESC-0603-470R-1%-1/10W: RESISTOR,470R,1%,100mW,0603 (1608); Manufacturer 1: UNI-ROYAL; Manufacturer Part Number 1: 0603WAF4700T5E; Location: *; LCSC: C23179
R48 = RESC-0603-12K-1%-1/10W: RESISTOR,12K,1%,100mW,0603 (1608); Manufacturer 1: STACKPOLE; Manufacturer Part Number 1: RMCF0603FT12K0; Location: *; LCSC: C22790; MOUSER: 708-RMCF0603FT12K0
SW1-SW8 = SWITCH-XUNPU-TS-1088-AR02016: SWITCH,TACT,SMD,2PIN,SMT,TOP ACTUATOR; Manufacturer 1: XUNPU; LCSC: C720477; Manufacturer Part Number 1: TS-1088-AR02016
SW9 SW10 = SWITCH-BOURNS-PEC12R-4130F-S0012: SWITCH,ENCODER+CLICK,12 DETENTS,30mm,BOURNS,PEC12R-4130F-S0012; LCSC: C143795; Manufacturer 1: BOURNS; Manufacturer Part Number 1: PEC12R-4130F-S0012
SW11 = SWITCH-WURTH-450301014042: SWITCH,SPDT,SLIDE,2.45MM,WURTH-450301014042; Manufacturer 1: SM SWITCH; Manufacturer Part Number 1: BSI-10; LCSC: C2985934
U1 = IC-ALTERA-5M240-TQFP100: IC,LOGIC,CPLD,ALTERA,5M240-TQFP100; Manufacturer 1: Intel/Altera; Manufacturer Part Number 1: 5M240ZT100C5N; LCSC: C192889
U2 = IC-FTDI-FT2232H: IC,XCVR,USB UART,DUAL,FTDI,FT2232H,QFP64; Manufacturer Part Number 1: FT2232HL-REEL; LCSC: C27882; Manufacturer 1: FTDI
U3 = IC-ONSEMI-NCP1117-3V3: IC,VOLTAGE REG,LIN,POSITIVE,3V3,NCP1117-33,SOT223; Manufacturer 1: ONSEMI; Manufacturer Part Number 1: NCP1117ST33T3G; LCSC: C26537
U4 = IC-MICROCHIPIC-93LC56-SOT26: IC,EEPROM,2KBIT,MICROWIRE,MICROCHIP,93LC56BT-I/OT; LCSC: C190271; Manufacturer 1: MICROCHIP; Manufacturer Part Number 1: 93LC56BT-I/OT
U5 = IC-ONSEMI-NCP1117-1V8: IC,VOLTAGE REG,LIN,POSITIVE,1V8,NCP1117-18,SOT223; Manufacturer 1: ONSEMI; Manufacturer Part Number 1: NCP1117IST18T3G; LCSC: C2902118
U6 = IC-ONSEMI-NLV14551B: IC,ANALOG,4PDT ANALOG SWITCH,ONSEMI,NLV14551,SO16; Manufacturer Part Number 1: NLV14551BDR2G; LCSC: C904812; Manufacturer 1: ONSEMI
X1 X2 = XOSC-JLYE-Y322512MNCCZ: XOSC,12MHz,3225; Manufacturer 1: JLYE; LCSC: C49207924; Manufacturer Part Number 1: Y322512MNCCZ

## Sheet CPLD-V-HEADERBANK.SchDoc
size A4; SheetNumber: 3; SheetTotal: 3
Used 6 times, as channels U_CPLD-V-HEADERBANK, U_CPLD-V-HEADERBANK, U_CPLD-V-HEADERBANK, U_CPLD-V-HEADERBANK, U_CPLD-V-HEADERBANK, U_CPLD-V-HEADERBANK. Parts and nets are listed once, with the designators drawn on the sheet.
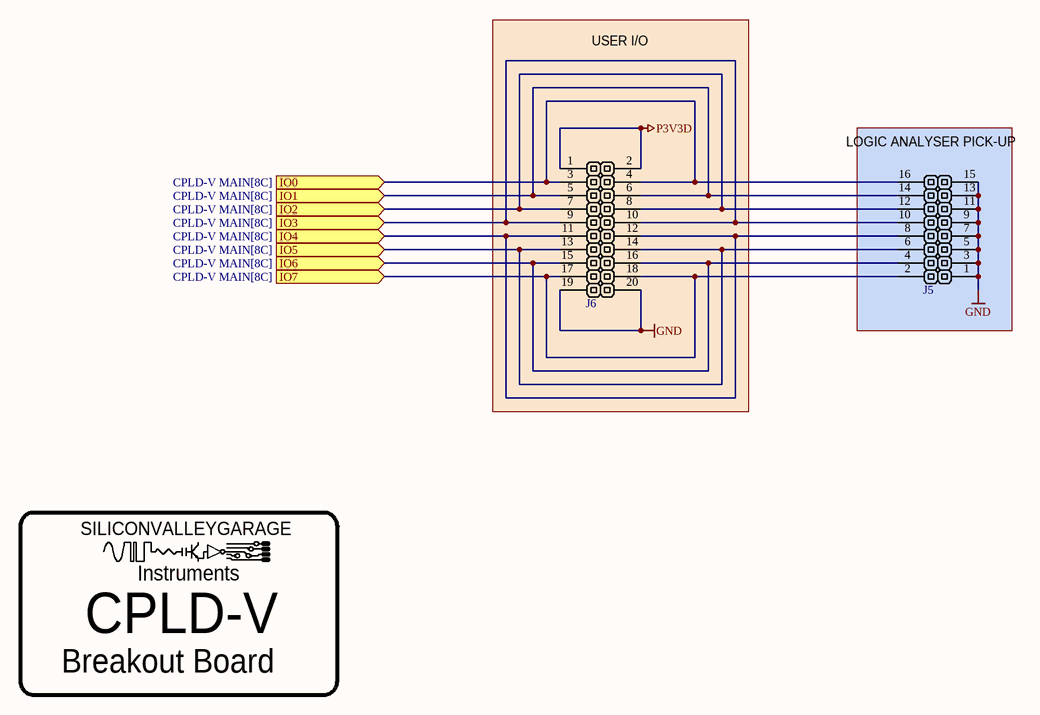
[diagram p3: CPLD-V-HEADERBANK.SchDoc]

### Parts
J5  BOXHEADER-3X2  [CONNECTOR-GENERIC-PINHEADER-2X8]  (value not drawn)
J6  BOXHEADER-3X2  [CONNECTOR-GENERIC-PINHEADER-2X10]  (value not drawn)
LOGO?  LOGO-SILICONVALLEYGARAGE-SMALL  [SILICONVALLEYGARAGE]  (value not drawn)  (graphical)

### Blocks framed on the sheet
USER I/O: J6
LOGIC ANALYSER PICK-UP: J5
CPLD-V: LOGO?

### Ports
IO0 (in, see CPLD-V MAIN[8C]), IO1 (in, see CPLD-V MAIN[8C]), IO2 (in, see CPLD-V MAIN[8C]), IO3 (in, see CPLD-V MAIN[8C]), IO4 (in, see CPLD-V MAIN[8C]), IO5 (in, see CPLD-V MAIN[8C]), IO6 (in, see CPLD-V MAIN[8C]), IO7 (in, see CPLD-V MAIN[8C])

### Nets
GND: J5.1(+) J5.3(-) J5.5(-) J5.7(-) J5.9(-) J5.11(-) J5.13(-) J5.15(-) J6.19(-) J6.20(-)
P3V3D: J6.1(+) J6.2(-)
IO0: J5.16(-) J6.3(-) J6.4(-) ; port IO0
IO1: J5.14(-) J6.5(-) J6.6(-) ; port IO1
IO2: J5.12(-) J6.7(-) J6.8(-) ; port IO2
IO3: J5.10(-) J6.9(-) J6.10(-) ; port IO3
IO4: J5.8(-) J6.11(-) J6.12(-) ; port IO4
IO5: J5.6(-) J6.13(-) J6.14(-) ; port IO5
IO6: J5.4(-) J6.15(-) J6.16(-) ; port IO6
IO7: J5.2(-) J6.17(-) J6.18(-) ; port IO7

### Channels
U_CPLD-V-HEADERBANK: designators J5=J5_U_CPLD-V-HEADERBANK6 J6=J6_U_CPLD-V-HEADERBANK6 LOGO?=LOGO?_U_CPLD-V-HEADERBANK#1; ports IO0=PIN28 IO1=PIN29 IO2=PIN30 IO3=PIN33 IO4=PIN34 IO5=PIN35 IO6=PIN36 IO7=PIN37
U_CPLD-V-HEADERBANK: designators J5=J5_U_CPLD-V-HEADERBANK5 J6=J6_U_CPLD-V-HEADERBANK5 LOGO?=LOGO?_U_CPLD-V-HEADERBANK#2; ports IO0=PIN38 IO1=PIN39 IO2=PIN40 IO3=PIN41 IO4=PIN42 IO5=PIN47 IO6=PIN48 IO7=PIN49
U_CPLD-V-HEADERBANK: designators J5=J5_U_CPLD-V-HEADERBANK4 J6=J6_U_CPLD-V-HEADERBANK4 LOGO?=LOGO?_U_CPLD-V-HEADERBANK#3; ports IO0=PIN50 IO1=PIN51 IO2=PIN52 IO3=PIN53 IO4=PIN54 IO5=PIN55 IO6=PIN56 IO7=PIN57
U_CPLD-V-HEADERBANK: designators J5=J5_U_CPLD-V-HEADERBANK3 J6=J6_U_CPLD-V-HEADERBANK3 LOGO?=LOGO?_U_CPLD-V-HEADERBANK#4; ports IO0=PIN58 IO1=PIN61 IO2=PIN66 IO3=PIN67 IO4=PIN68 IO5=PIN69 IO6=PIN70 IO7=PIN71
U_CPLD-V-HEADERBANK: designators J5=J5_U_CPLD-V-HEADERBANK2 J6=J6_U_CPLD-V-HEADERBANK2 LOGO?=LOGO?_U_CPLD-V-HEADERBANK#5; ports IO0=PIN72 IO1=PIN73 IO2=PIN74 IO3=PIN75 IO4=PIN76 IO5=PIN77 IO6=PIN78 IO7=PIN81
U_CPLD-V-HEADERBANK: designators J5=J5_U_CPLD-V-HEADERBANK1 J6=J6_U_CPLD-V-HEADERBANK1 LOGO?=LOGO?_U_CPLD-V-HEADERBANK#6; ports IO0=PIN82 IO1=PIN83 IO2=PIN84 IO3=PIN85 IO4=PIN86 IO5=PIN87 IO6=PIN88 IO7=PIN89

### Notes on the sheet
- (near LOGO?) Instruments
- Breakout Board
- (in symbol LOGO-SILICONVALLEYGARAGE-SMALL) SILICONVALLEYGARAGE

### Library data of the parts
J5 = CONN-HEADER-MALE-2X8: CONN,HEADER,2X8,2.54mm; LCSC: C42431826
J6 = CONN-HEADER-MALE-2X10: CONN,HEADER,2X10,2.54mm; LCSC: C5383109
LOGO? = LOGO-SILICONVALLEYGARAGE-SMALL: LOGO,SILICONVALLEYGARAGE,SMALL

## Nets that join several sheets
GND: CPLD-V MAIN (103 pins), U_CPLD-V-HEADERBANK (10 pins), U_CPLD-V-HEADERBANK (10 pins), U_CPLD-V-HEADERBANK (10 pins), U_CPLD-V-HEADERBANK (10 pins), U_CPLD-V-HEADERBANK (10 pins), U_CPLD-V-HEADERBANK (10 pins)
P3V3D: CPLD-V MAIN (67 pins), U_CPLD-V-HEADERBANK (J6_U_CPLD-V-HEADERBANK6.1 J6_U_CPLD-V-HEADERBANK6.2), U_CPLD-V-HEADERBANK (J6_U_CPLD-V-HEADERBANK5.1 J6_U_CPLD-V-HEADERBANK5.2), U_CPLD-V-HEADERBANK (J6_U_CPLD-V-HEADERBANK4.1 J6_U_CPLD-V-HEADERBANK4.2), U_CPLD-V-HEADERBANK (J6_U_CPLD-V-HEADERBANK3.1 J6_U_CPLD-V-HEADERBANK3.2), U_CPLD-V-HEADERBANK (J6_U_CPLD-V-HEADERBANK2.1 J6_U_CPLD-V-HEADERBANK2.2), U_CPLD-V-HEADERBANK (J6_U_CPLD-V-HEADERBANK1.1 J6_U_CPLD-V-HEADERBANK1.2)
PIN28: CPLD-V MAIN (U1.28), U_CPLD-V-HEADERBANK (J5_U_CPLD-V-HEADERBANK6.16 J6_U_CPLD-V-HEADERBANK6.3 J6_U_CPLD-V-HEADERBANK6.4)
PIN29: CPLD-V MAIN (U1.29), U_CPLD-V-HEADERBANK (J5_U_CPLD-V-HEADERBANK6.14 J6_U_CPLD-V-HEADERBANK6.5 J6_U_CPLD-V-HEADERBANK6.6)
PIN30: CPLD-V MAIN (U1.30), U_CPLD-V-HEADERBANK (J5_U_CPLD-V-HEADERBANK6.12 J6_U_CPLD-V-HEADERBANK6.7 J6_U_CPLD-V-HEADERBANK6.8)
PIN33: CPLD-V MAIN (U1.33), U_CPLD-V-HEADERBANK (J5_U_CPLD-V-HEADERBANK6.10 J6_U_CPLD-V-HEADERBANK6.9 J6_U_CPLD-V-HEADERBANK6.10)
PIN34: CPLD-V MAIN (U1.34), U_CPLD-V-HEADERBANK (J5_U_CPLD-V-HEADERBANK6.8 J6_U_CPLD-V-HEADERBANK6.11 J6_U_CPLD-V-HEADERBANK6.12)
PIN35: CPLD-V MAIN (U1.35), U_CPLD-V-HEADERBANK (J5_U_CPLD-V-HEADERBANK6.6 J6_U_CPLD-V-HEADERBANK6.13 J6_U_CPLD-V-HEADERBANK6.14)
PIN36: CPLD-V MAIN (U1.36), U_CPLD-V-HEADERBANK (J5_U_CPLD-V-HEADERBANK6.4 J6_U_CPLD-V-HEADERBANK6.15 J6_U_CPLD-V-HEADERBANK6.16)
PIN37: CPLD-V MAIN (U1.37), U_CPLD-V-HEADERBANK (J5_U_CPLD-V-HEADERBANK6.2 J6_U_CPLD-V-HEADERBANK6.17 J6_U_CPLD-V-HEADERBANK6.18)
PIN38: CPLD-V MAIN (U1.38), U_CPLD-V-HEADERBANK (J5_U_CPLD-V-HEADERBANK5.16 J6_U_CPLD-V-HEADERBANK5.3 J6_U_CPLD-V-HEADERBANK5.4)
PIN39: CPLD-V MAIN (U1.39), U_CPLD-V-HEADERBANK (J5_U_CPLD-V-HEADERBANK5.14 J6_U_CPLD-V-HEADERBANK5.5 J6_U_CPLD-V-HEADERBANK5.6)
PIN40: CPLD-V MAIN (U1.40), U_CPLD-V-HEADERBANK (J5_U_CPLD-V-HEADERBANK5.12 J6_U_CPLD-V-HEADERBANK5.7 J6_U_CPLD-V-HEADERBANK5.8)
PIN41: CPLD-V MAIN (U1.41), U_CPLD-V-HEADERBANK (J5_U_CPLD-V-HEADERBANK5.10 J6_U_CPLD-V-HEADERBANK5.9 J6_U_CPLD-V-HEADERBANK5.10)
PIN42: CPLD-V MAIN (U1.42), U_CPLD-V-HEADERBANK (J5_U_CPLD-V-HEADERBANK5.8 J6_U_CPLD-V-HEADERBANK5.11 J6_U_CPLD-V-HEADERBANK5.12)
PIN47: CPLD-V MAIN (U1.47), U_CPLD-V-HEADERBANK (J5_U_CPLD-V-HEADERBANK5.6 J6_U_CPLD-V-HEADERBANK5.13 J6_U_CPLD-V-HEADERBANK5.14)
PIN48: CPLD-V MAIN (U1.48), U_CPLD-V-HEADERBANK (J5_U_CPLD-V-HEADERBANK5.4 J6_U_CPLD-V-HEADERBANK5.15 J6_U_CPLD-V-HEADERBANK5.16)
PIN49: CPLD-V MAIN (U1.49), U_CPLD-V-HEADERBANK (J5_U_CPLD-V-HEADERBANK5.2 J6_U_CPLD-V-HEADERBANK5.17 J6_U_CPLD-V-HEADERBANK5.18)
PIN50: CPLD-V MAIN (U1.50), U_CPLD-V-HEADERBANK (J5_U_CPLD-V-HEADERBANK4.16 J6_U_CPLD-V-HEADERBANK4.3 J6_U_CPLD-V-HEADERBANK4.4)
PIN51: CPLD-V MAIN (U1.51), U_CPLD-V-HEADERBANK (J5_U_CPLD-V-HEADERBANK4.14 J6_U_CPLD-V-HEADERBANK4.5 J6_U_CPLD-V-HEADERBANK4.6)
PIN52: CPLD-V MAIN (U1.52), U_CPLD-V-HEADERBANK (J5_U_CPLD-V-HEADERBANK4.12 J6_U_CPLD-V-HEADERBANK4.7 J6_U_CPLD-V-HEADERBANK4.8)
PIN53: CPLD-V MAIN (U1.53), U_CPLD-V-HEADERBANK (J5_U_CPLD-V-HEADERBANK4.10 J6_U_CPLD-V-HEADERBANK4.9 J6_U_CPLD-V-HEADERBANK4.10)
PIN54: CPLD-V MAIN (U1.54), U_CPLD-V-HEADERBANK (J5_U_CPLD-V-HEADERBANK4.8 J6_U_CPLD-V-HEADERBANK4.11 J6_U_CPLD-V-HEADERBANK4.12)
PIN55: CPLD-V MAIN (U1.55), U_CPLD-V-HEADERBANK (J5_U_CPLD-V-HEADERBANK4.6 J6_U_CPLD-V-HEADERBANK4.13 J6_U_CPLD-V-HEADERBANK4.14)
PIN56: CPLD-V MAIN (U1.56), U_CPLD-V-HEADERBANK (J5_U_CPLD-V-HEADERBANK4.4 J6_U_CPLD-V-HEADERBANK4.15 J6_U_CPLD-V-HEADERBANK4.16)
PIN57: CPLD-V MAIN (U1.57), U_CPLD-V-HEADERBANK (J5_U_CPLD-V-HEADERBANK4.2 J6_U_CPLD-V-HEADERBANK4.17 J6_U_CPLD-V-HEADERBANK4.18)
PIN58: CPLD-V MAIN (U1.58), U_CPLD-V-HEADERBANK (J5_U_CPLD-V-HEADERBANK3.16 J6_U_CPLD-V-HEADERBANK3.3 J6_U_CPLD-V-HEADERBANK3.4)
PIN61: CPLD-V MAIN (U1.61), U_CPLD-V-HEADERBANK (J5_U_CPLD-V-HEADERBANK3.14 J6_U_CPLD-V-HEADERBANK3.5 J6_U_CPLD-V-HEADERBANK3.6)
PIN66: CPLD-V MAIN (U1.66), U_CPLD-V-HEADERBANK (J5_U_CPLD-V-HEADERBANK3.12 J6_U_CPLD-V-HEADERBANK3.7 J6_U_CPLD-V-HEADERBANK3.8)
PIN67: CPLD-V MAIN (U1.67), U_CPLD-V-HEADERBANK (J5_U_CPLD-V-HEADERBANK3.10 J6_U_CPLD-V-HEADERBANK3.9 J6_U_CPLD-V-HEADERBANK3.10)
PIN68: CPLD-V MAIN (U1.68), U_CPLD-V-HEADERBANK (J5_U_CPLD-V-HEADERBANK3.8 J6_U_CPLD-V-HEADERBANK3.11 J6_U_CPLD-V-HEADERBANK3.12)
PIN69: CPLD-V MAIN (U1.69), U_CPLD-V-HEADERBANK (J5_U_CPLD-V-HEADERBANK3.6 J6_U_CPLD-V-HEADERBANK3.13 J6_U_CPLD-V-HEADERBANK3.14)
PIN70: CPLD-V MAIN (U1.70), U_CPLD-V-HEADERBANK (J5_U_CPLD-V-HEADERBANK3.4 J6_U_CPLD-V-HEADERBANK3.15 J6_U_CPLD-V-HEADERBANK3.16)
PIN71: CPLD-V MAIN (U1.71), U_CPLD-V-HEADERBANK (J5_U_CPLD-V-HEADERBANK3.2 J6_U_CPLD-V-HEADERBANK3.17 J6_U_CPLD-V-HEADERBANK3.18)
PIN72: CPLD-V MAIN (U1.72), U_CPLD-V-HEADERBANK (J5_U_CPLD-V-HEADERBANK2.16 J6_U_CPLD-V-HEADERBANK2.3 J6_U_CPLD-V-HEADERBANK2.4)
PIN73: CPLD-V MAIN (U1.73), U_CPLD-V-HEADERBANK (J5_U_CPLD-V-HEADERBANK2.14 J6_U_CPLD-V-HEADERBANK2.5 J6_U_CPLD-V-HEADERBANK2.6)
PIN74: CPLD-V MAIN (U1.74), U_CPLD-V-HEADERBANK (J5_U_CPLD-V-HEADERBANK2.12 J6_U_CPLD-V-HEADERBANK2.7 J6_U_CPLD-V-HEADERBANK2.8)
PIN75: CPLD-V MAIN (U1.75), U_CPLD-V-HEADERBANK (J5_U_CPLD-V-HEADERBANK2.10 J6_U_CPLD-V-HEADERBANK2.9 J6_U_CPLD-V-HEADERBANK2.10)
PIN76: CPLD-V MAIN (U1.76), U_CPLD-V-HEADERBANK (J5_U_CPLD-V-HEADERBANK2.8 J6_U_CPLD-V-HEADERBANK2.11 J6_U_CPLD-V-HEADERBANK2.12)
PIN77: CPLD-V MAIN (U1.77), U_CPLD-V-HEADERBANK (J5_U_CPLD-V-HEADERBANK2.6 J6_U_CPLD-V-HEADERBANK2.13 J6_U_CPLD-V-HEADERBANK2.14)
PIN78: CPLD-V MAIN (U1.78), U_CPLD-V-HEADERBANK (J5_U_CPLD-V-HEADERBANK2.4 J6_U_CPLD-V-HEADERBANK2.15 J6_U_CPLD-V-HEADERBANK2.16)
PIN81: CPLD-V MAIN (U1.81), U_CPLD-V-HEADERBANK (J5_U_CPLD-V-HEADERBANK2.2 J6_U_CPLD-V-HEADERBANK2.17 J6_U_CPLD-V-HEADERBANK2.18)
PIN82: CPLD-V MAIN (U1.82), U_CPLD-V-HEADERBANK (J5_U_CPLD-V-HEADERBANK1.16 J6_U_CPLD-V-HEADERBANK1.3 J6_U_CPLD-V-HEADERBANK1.4)
PIN83: CPLD-V MAIN (U1.83), U_CPLD-V-HEADERBANK (J5_U_CPLD-V-HEADERBANK1.14 J6_U_CPLD-V-HEADERBANK1.5 J6_U_CPLD-V-HEADERBANK1.6)
PIN84: CPLD-V MAIN (U1.84), U_CPLD-V-HEADERBANK (J5_U_CPLD-V-HEADERBANK1.12 J6_U_CPLD-V-HEADERBANK1.7 J6_U_CPLD-V-HEADERBANK1.8)
PIN85: CPLD-V MAIN (U1.85), U_CPLD-V-HEADERBANK (J5_U_CPLD-V-HEADERBANK1.10 J6_U_CPLD-V-HEADERBANK1.9 J6_U_CPLD-V-HEADERBANK1.10)
PIN86: CPLD-V MAIN (U1.86), U_CPLD-V-HEADERBANK (J5_U_CPLD-V-HEADERBANK1.8 J6_U_CPLD-V-HEADERBANK1.11 J6_U_CPLD-V-HEADERBANK1.12)
PIN87: CPLD-V MAIN (U1.87), U_CPLD-V-HEADERBANK (J5_U_CPLD-V-HEADERBANK1.6 J6_U_CPLD-V-HEADERBANK1.13 J6_U_CPLD-V-HEADERBANK1.14)
PIN88: CPLD-V MAIN (U1.88), U_CPLD-V-HEADERBANK (J5_U_CPLD-V-HEADERBANK1.4 J6_U_CPLD-V-HEADERBANK1.15 J6_U_CPLD-V-HEADERBANK1.16)
PIN89: CPLD-V MAIN (U1.89), U_CPLD-V-HEADERBANK (J5_U_CPLD-V-HEADERBANK1.2 J6_U_CPLD-V-HEADERBANK1.17 J6_U_CPLD-V-HEADERBANK1.18)

## Assembly variants
NOTH: not fitted J2 J3 J4 J5_U_CPLD-V-HEADERBANK1 J5_U_CPLD-V-HEADERBANK2 J5_U_CPLD-V-HEADERBANK3 J5_U_CPLD-V-HEADERBANK4 J5_U_CPLD-V-HEADERBANK5 J5_U_CPLD-V-HEADERBANK6 J6_U_CPLD-V-HEADERBANK1 J6_U_CPLD-V-HEADERBANK2 J6_U_CPLD-V-HEADERBANK3 J6_U_CPLD-V-HEADERBANK4 J6_U_CPLD-V-HEADERBANK5 J6_U_CPLD-V-HEADERBANK6 J8 SW9 SW10 SW11